# Altium schematic sheet Schematic.SchDoc
size A4
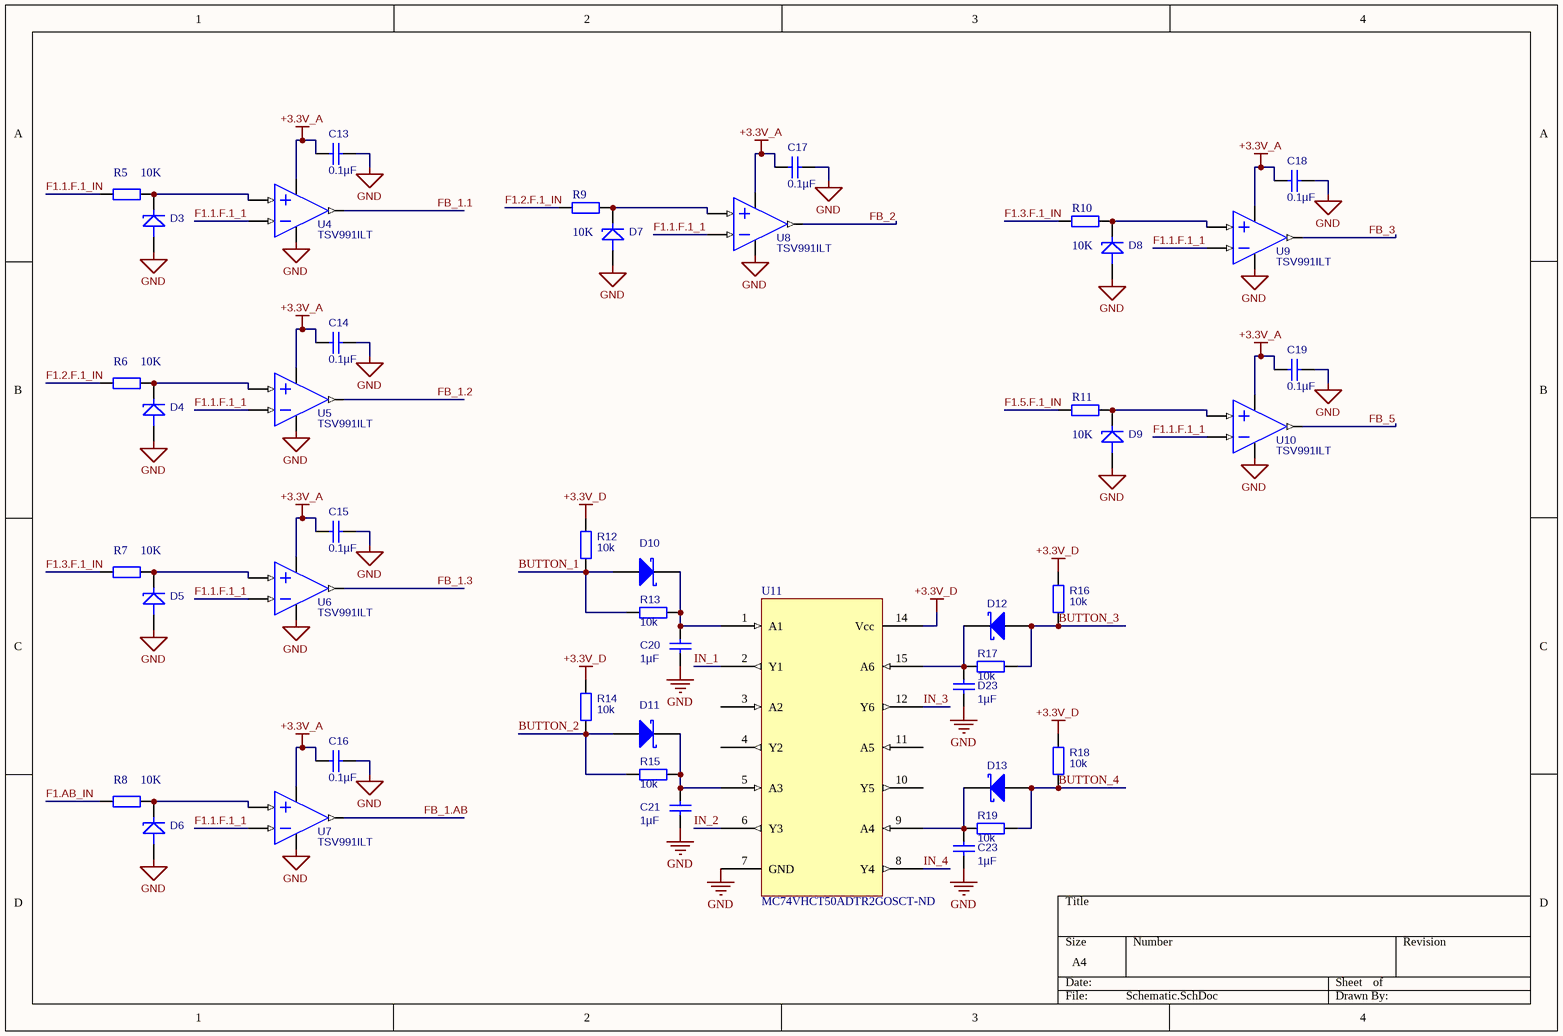
[diagram p0: Schematic.SchDoc]

## Parts
C13  value 0.1µF  [TDK C-Series (1608)]
C14  value 0.1µF  [TDK C-Series (1608)]
C15  value 0.1µF  [TDK C-Series (1608)]
C16  value 0.1µF  [TDK C-Series (1608)]
C17  value 0.1µF  [TDK C-Series (1608)]
C18  value 0.1µF  [TDK C-Series (1608)]
C19  value 0.1µF  [TDK C-Series (1608)]
C20  value 1µF  [TDK C-Series (1608)]  (hidden comment: Cap)
C21  value 1µF  [TDK C-Series (1608)]  (hidden comment: Cap)
C23  value 1µF  [TDK C-Series (1608)]  (hidden comment: Cap)
D3  PTVSxS1UR-Series  [NXP PTVSxS1UR-Series (SOD123W)]  (value not drawn)
D4  PTVSxS1UR-Series  [NXP PTVSxS1UR-Series (SOD123W)]  (value not drawn)
D5  PTVSxS1UR-Series  [NXP PTVSxS1UR-Series (SOD123W)]  (value not drawn)
D6  PTVSxS1UR-Series  [NXP PTVSxS1UR-Series (SOD123W)]  (value not drawn)
D7  PTVSxS1UR-Series  [NXP PTVSxS1UR-Series (SOD123W)]  (value not drawn)
D8  PTVSxS1UR-Series  [NXP PTVSxS1UR-Series (SOD123W)]  (value not drawn)
D9  PTVSxS1UR-Series  [NXP PTVSxS1UR-Series (SOD123W)]  (value not drawn)
D10  D Schottky  [NXP PMEG6020AELRX (SOD-123)]  (value not drawn)
D11  D Schottky  [NXP PMEG6020AELRX (SOD-123)]  (value not drawn)
D12  D Schottky  [NXP PMEG6020AELRX (SOD-123)]  (value not drawn)
D13  D Schottky  [NXP PMEG6020AELRX (SOD-123)]  (value not drawn)
D23  value 1µF  [TDK C-Series (1608)]  (hidden comment: Cap)
R5  value 10K  [AXIAL-0.4]
R6  value 10K  [AXIAL-0.4]
R7  value 10K  [AXIAL-0.4]
R8  value 10K  [AXIAL-0.4]
R9  value 10K  [AXIAL-0.4]
R10  value 10K  [AXIAL-0.4]
R11  value 10K  [AXIAL-0.4]
R12  value 10k  [Panasonic ERJ-Series (1608)]
R13  value 10k  [Panasonic ERJ-Series (1608)]
R14  value 10k  [Panasonic ERJ-Series (1608)]
R15  value 10k  [Panasonic ERJ-Series (1608)]
R16  value 10k  [Panasonic ERJ-Series (1608)]
R17  value 10k  [Panasonic ERJ-Series (1608)]
R18  value 10k  [Panasonic ERJ-Series (1608)]
R19  value 10k  [Panasonic ERJ-Series (1608)]
U4  TSV991ILT  [STMicroelectronics TSV991ILT (SOT-23-5)]
U5  TSV991ILT  [STMicroelectronics TSV991ILT (SOT-23-5)]
U6  TSV991ILT  [STMicroelectronics TSV991ILT (SOT-23-5)]
U7  TSV991ILT  [STMicroelectronics TSV991ILT (SOT-23-5)]
U8  TSV991ILT  [STMicroelectronics TSV991ILT (SOT-23-5)]
U9  TSV991ILT  [STMicroelectronics TSV991ILT (SOT-23-5)]
U10  TSV991ILT  [STMicroelectronics TSV991ILT (SOT-23-5)]
U11  Supplier Part Number 1: MC74VHCT50ADTR2GOSCT-ND  (hidden comment: MC74VHCT50A)

## Nets
+3.3V_A: C13.2 C14.2 C15.2 C16.2 C17.2 C18.2 C19.2 U4.5(VCC+) U5.5(VCC+) U6.5(VCC+) U7.5(VCC+) U8.5(VCC+) U9.5(VCC+) U10.5(VCC+)
+3.3V_D: R12.1 R14.1 R16.1 R18.1 U11.14(Vcc)
GND: C13.1 C14.1 C15.1 C16.1 C17.1 C18.1 C19.1 C20.1 C21.1 C23.1 D3.2 D4.2 D5.2 D6.2 D7.2 D8.2 D9.2 D23.1 U4.2(VCC-) U5.2(VCC-) U6.2(VCC-) U7.2(VCC-) U8.2(VCC-) U9.2(VCC-) U10.2(VCC-) U11.7(GND)
BUTTON_1: D10.1(A) R12.2 R13.1
BUTTON_2: D11.1(A) R14.2 R15.1
BUTTON_3: D12.1(A) R16.2 R17.2
BUTTON_4: D13.1(A) R18.2 R19.2
F1.1.F.1_1: U4.4(IN-) U5.4(IN-) U6.4(IN-) U7.4(IN-) U8.4(IN-) U9.4(IN-) U10.4(IN-)
F1.1.F.1_IN: R5.2
F1.2.F.1_IN: R6.2 R9.2
F1.3.F.1_IN: R7.2 R10.2
F1.5.F.1_IN: R11.2
F1.AB_IN: R8.2
FB_1.1: U4.1(OUT)
FB_1.2: U5.1(OUT)
FB_1.3: U6.1(OUT)
FB_1.AB: U7.1(OUT)
FB_2: U8.1(OUT)
FB_3: U9.1(OUT)
FB_5: U10.1(OUT)
IN_1: U11.2(Y1)
IN_2: U11.6(Y3)
IN_3: U11.12(Y6)
IN_4: U11.8(Y4)
NetC20_2: C20.2 D10.2(K) R13.2 U11.1(A1)
NetC21_2: C21.2 D11.2(K) R15.2 U11.5(A3)
NetC23_2: C23.2 D13.2(K) R19.1 U11.9(A4)
NetD3_1: D3.1 R5.1 U4.3(IN+)
NetD4_1: D4.1 R6.1 U5.3(IN+)
NetD5_1: D5.1 R7.1 U6.3(IN+)
NetD6_1: D6.1 R8.1 U7.3(IN+)
NetD7_1: D7.1 R9.1 U8.3(IN+)
NetD8_1: D8.1 R10.1 U9.3(IN+)
NetD9_1: D9.1 R11.1 U10.3(IN+)
NetD12_2: D12.2(K) D23.2 R17.1 U11.15(A6)

Not connected (* = marked no-connect by the designer): U11 3(A2) 4(Y2) 10(Y5) 11(A5)

## Library data of the parts
C13-C21 C23 D23 = Cap: Capacitor; Published: 8-Jun-2000; LatestRevisionDate: 17-Jul-2002; LatestRevisionNote: Re-released for DXP Platform.; PackageReference: RAD-0.3; Publisher: Altium Limited; PackageDescription: Radial Cap, Thru-Hole; 2 Leads; 0.3 in Pin Spacing; Supplier 1: Digi-Key
  C13-C19: Supplier Part Number 1: 445-1316-1-ND
  C20 C21 C23 D23: Supplier Part Number 1: 445-5956-1-ND
D3-D9 = NXP PTVSxS1UR-Series: 400W TVS Diode; Supplier 1: Digi-Key; Supplier Part Number 1: 568-6546-1-ND
D10-D13 = D Schottky: Schottky Diode; pin to pad: 1>2 2>1; Published: 8-Jun-2000; LatestRevisionDate: 17-Jul-2002; LatestRevisionNote: Re-released for DXP Platform.; Publisher: Altium Limited; Supplier 1: Digi-Key; Supplier Part Number 1: 568-12710-1-ND
R5-R19 = Res2: Resistor; Published: 8-Jun-2000; LatestRevisionDate: 17-Jul-2002; LatestRevisionNote: Re-released for DXP Platform.; PackageReference: AXIAL-0.4; Publisher: Altium Limited; PackageDescription: Axial Device, Thru-Hole; 2 Leads; 0.4 in Pin Spacing; Supplier 1: Digi-Key
  R5-R11: Supplier 2: Digi-Key; Supplier Part Number 2: P10.0KHCT-ND
  R12-R19: Supplier Part Number 1: P10.0KHCT-ND
U4-U10 = STMicroelectronics TSV991ILT: 20MHz Op-Amp; Supplier 1: Digi-Key; Supplier Part Number 1: 497-6001-6-ND
U11 = MC74VHCT50A: 6-Channel CMOS Buffer; Supplier 1: Digi-Key